# EAGLE design vending-machine-row-controller (EAGLE 5.12)
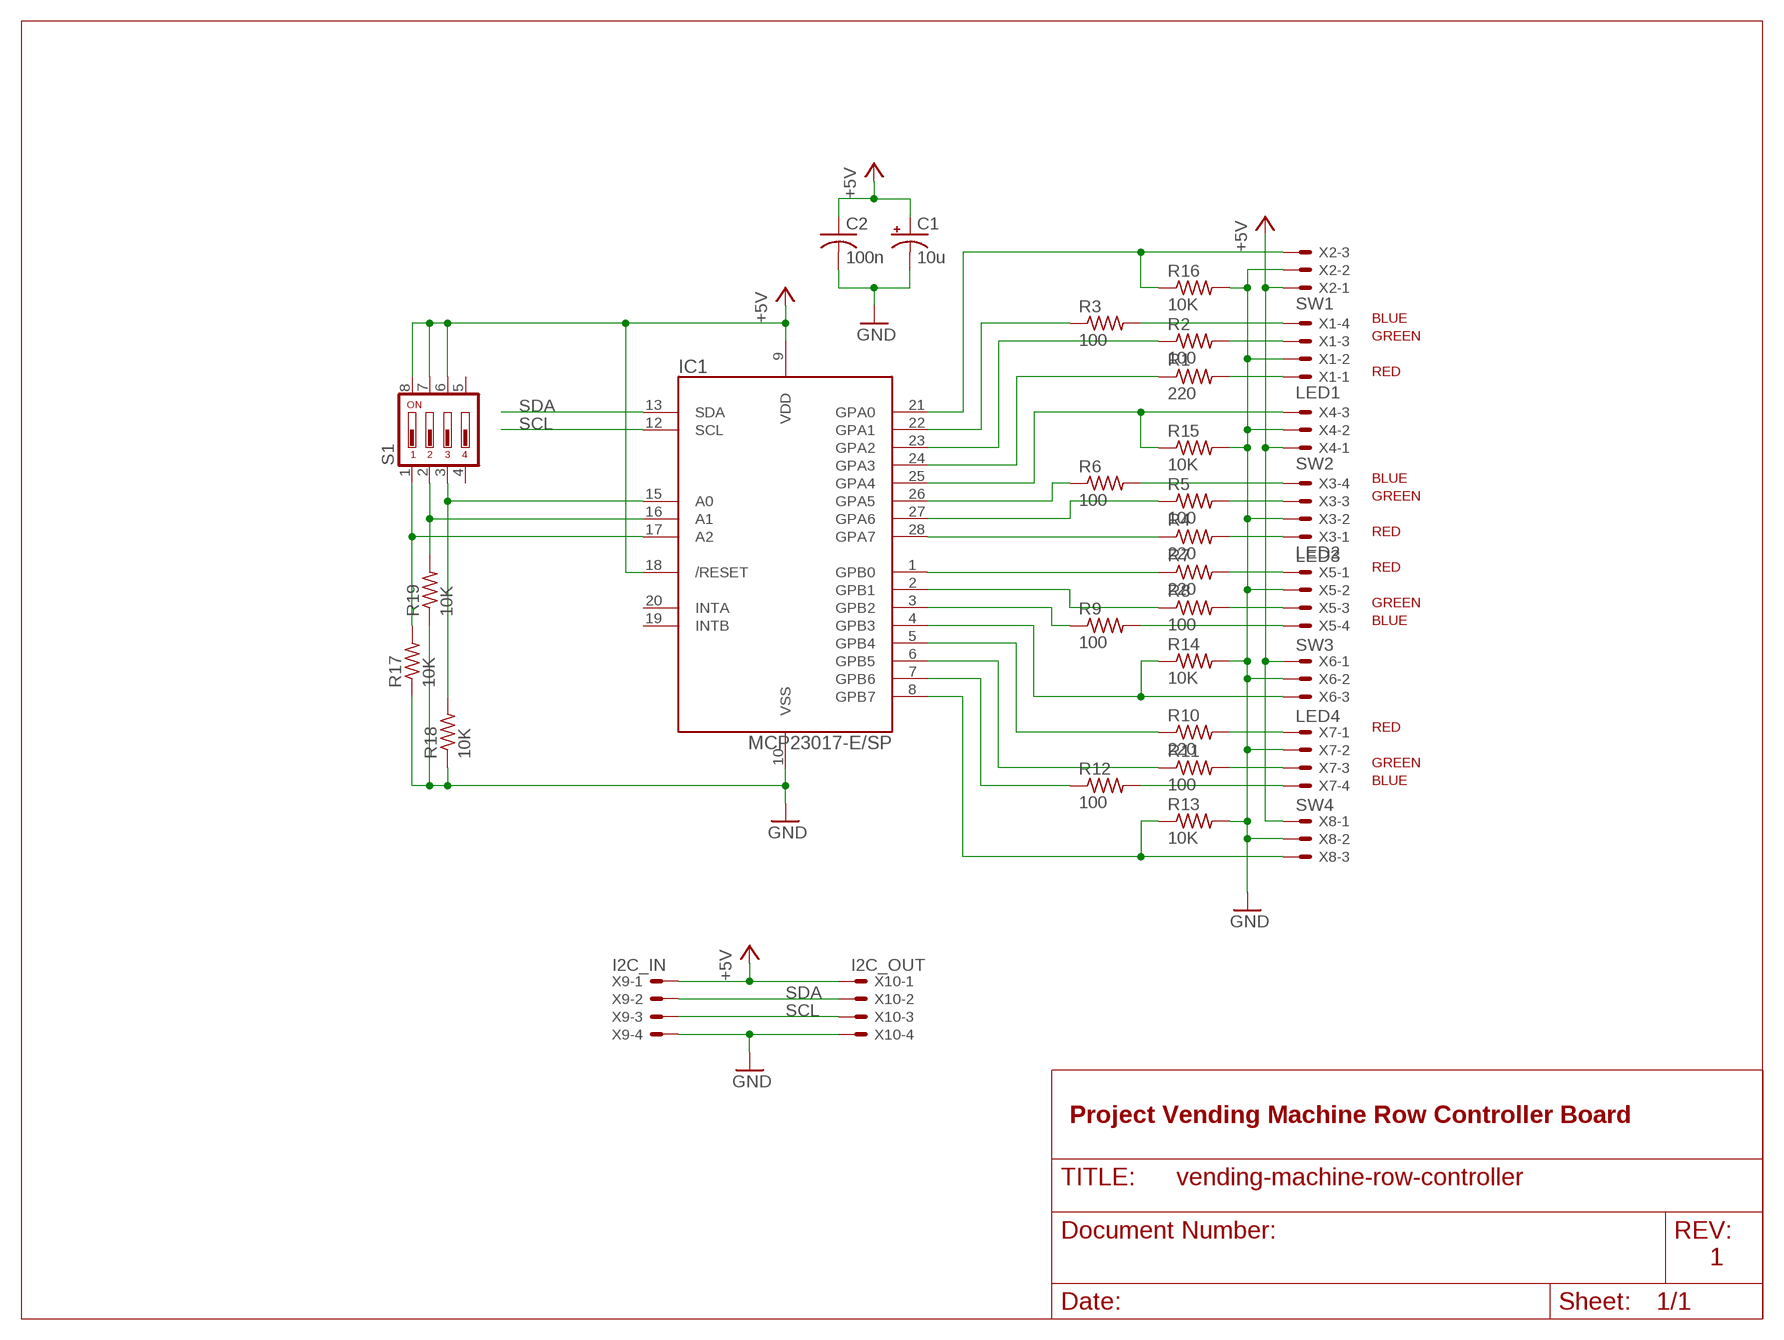
[diagram p0: schematic, sheet 1]

## Parts
C1  10u  CPOL-USE2.5-5  [E2,5-5]
C2  100n  C-US050-025X075  [C050-025X075]
IC1  MCP23017-E/SP  [DIP-28S]
R1  220  R-US_0207/10  [0207/10]
R2  100  R-US_0207/10  [0207/10]
R3  100  R-US_0207/10  [0207/10]
R4  220  R-US_0207/10  [0207/10]
R5  100  R-US_0207/10  [0207/10]
R6  100  R-US_0207/10  [0207/10]
R7  220  R-US_0207/10  [0207/10]
R8  100  R-US_0207/10  [0207/10]
R9  100  R-US_0207/10  [0207/10]
R10  220  R-US_0207/10  [0207/10]
R11  100  R-US_0207/10  [0207/10]
R12  100  R-US_0207/10  [0207/10]
R13  10K  R-US_0207/10  [0207/10]
R14  10K  R-US_0207/10  [0207/10]
R15  10K  R-US_0207/10  [0207/10]
R16  10K  R-US_0207/10  [0207/10]
R17  10K  R-US_R0805  [R0805]
R18  10K  R-US_R0805  [R0805]
R19  10K  R-US_R0805  [R0805]
S1  DIP04YL  [DIP04YL]
X1  LED1  22-23-2041  [22-23-2041]
X2  SW1  22-23-2031  [22-23-2031]
X3  LED2  22-23-2041  [22-23-2041]
X4  SW2  22-23-2031  [22-23-2031]
X5  LED3  22-23-2041  [22-23-2041]
X6  SW3  22-23-2031  [22-23-2031]
X7  LED4  22-23-2041  [22-23-2041]
X8  SW4  22-23-2031  [22-23-2031]
X9  I2C_IN  22-23-2041  [22-23-2041]
X10  I2C_OUT  22-23-2041  [22-23-2041]

## Nets
+5V: C1.+ C2.1 IC1.9(VDD) IC1.18(/RESET) S1.6 S1.7 S1.8 X2.1 X4.1 X6.1 X8.1 X9.1 X10.1
GND: C1.- C2.2 IC1.10(VSS) R13.2 R14.2 R15.2 R16.2 R17.1 R18.1 R19.1 X1.2 X2.2 X3.2 X4.2 X5.2 X6.2 X7.2 X8.2 X9.4 X10.4
N$1: R12.2 X7.4
N$2: R11.2 X7.3
N$3: R10.2 X7.1
N$4: R9.2 X5.4
N$5: R8.2 X5.3
N$6: R7.2 X5.1
N$7: R6.2 X3.4
N$8: R5.2 X3.3
N$9: R4.2 X3.1
N$10: R3.2 X1.4
N$11: R2.2 X1.3
N$12: R1.2 X1.1
N$13: IC1.17(A2) R17.2 S1.1
N$14: IC1.1(GPB0) R7.1
N$15: IC1.2(GPB1) R8.1
N$16: IC1.3(GPB2) R9.1
N$17: IC1.5(GPB4) R10.1
N$18: IC1.6(GPB5) R11.1
N$19: IC1.7(GPB6) R12.1
N$20: IC1.8(GPB7) R13.1 X8.3
N$21: IC1.4(GPB3) R14.1 X6.3
N$22: IC1.16(A1) R19.2 S1.2
N$23: IC1.28(GPA7) R4.1
N$24: IC1.27(GPA6) R5.1
N$25: IC1.26(GPA5) R6.1
N$26: IC1.25(GPA4) R15.1 X4.3
N$27: IC1.24(GPA3) R1.1
N$28: IC1.23(GPA2) R2.1
N$29: IC1.22(GPA1) R3.1
N$30: IC1.21(GPA0) R16.1 X2.3
N$31: IC1.15(A0) R18.2 S1.3
SCL: IC1.12(SCL) X9.3 X10.3
SDA: IC1.13(SDA) X9.2 X10.2
Unconnected: IC1.19(INTB) IC1.20(INTA) S1.4 S1.5

## Notes on the sheet
- BLUE
- GREEN
- RED
- BLUE
- GREEN
- RED
- RED
- GREEN
- BLUE
- RED
- GREEN
- BLUE
- Project Vending Machine Row Controller Board
- 1

## Library data of the parts
C1 = rcl:CPOL-US: POLARIZED CAPACITOR, American symbol
C2 = rcl:C-US: CAPACITOR, American symbol
IC1 = rbg-microchip-ioexpander:MCP23017
R1-R19 = rcl:R-US_: RESISTOR, American symbol
S1 = switch-dil:DIP04YL: DIL/CODE SWITCH; OC_FARNELL: unknown; OC_NEWARK: unknown
X1 X3 X5 X7 X9 X10 = con-molex:22-23-2041: .100" (2.54mm) Center Header - 4 Pin; MF: MOLEX; MPN: 22-23-2041; OC_FARNELL: 1462920; OC_NEWARK: 38C0355
X2 X4 X6 X8 = con-molex:22-23-2031: .100" (2.54mm) Center Header - 3 Pin; MF: MOLEX; MPN: 22-23-2031; OC_FARNELL: 1462950; OC_NEWARK: 30C0862

## Board
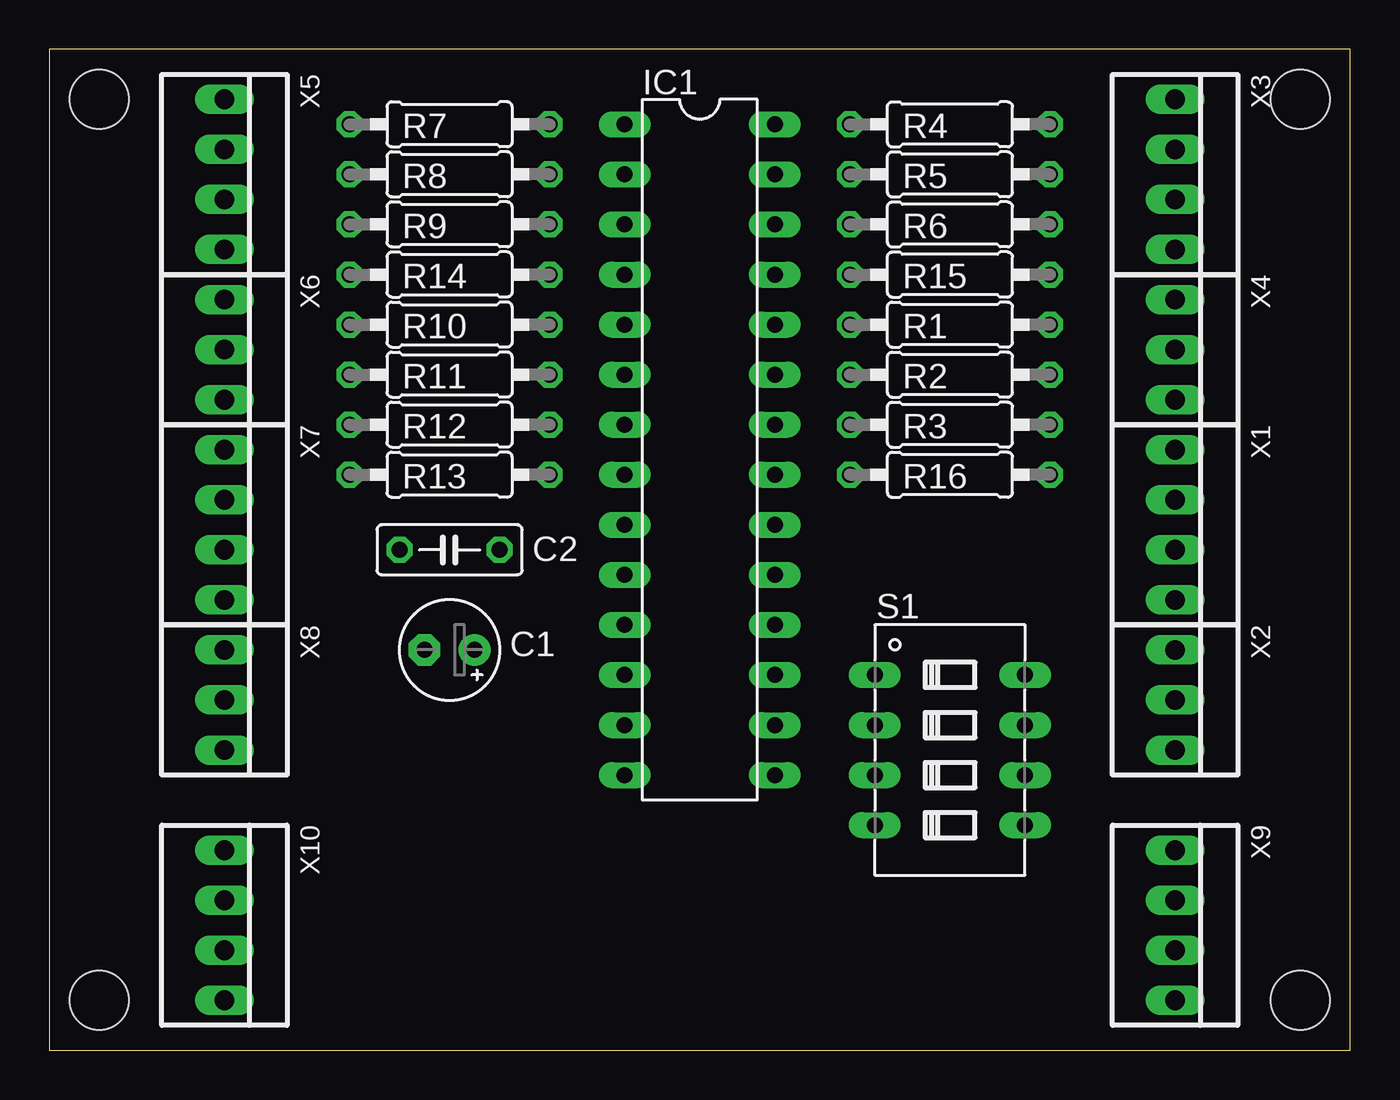
[diagram p1: board, top side]
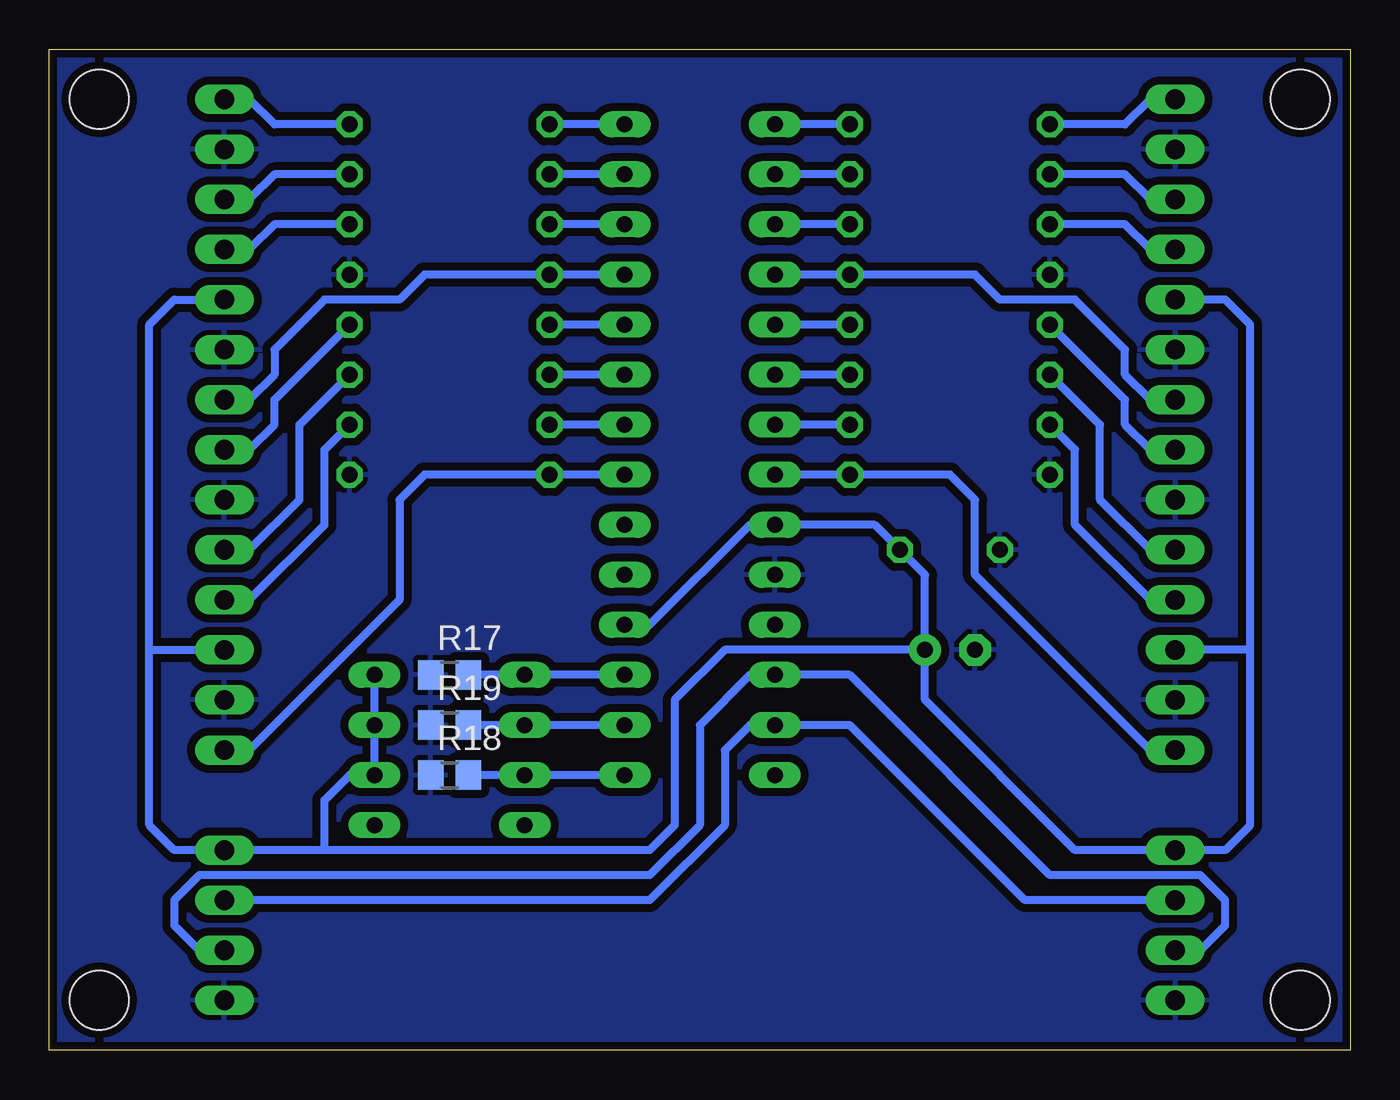
[diagram p2: board, bottom side, seen from below]

Size 66.04 x 50.8 mm. Coordinates in mm from the lower left corner, seen from the top.
Outline: 0,0 66.04,0 66.04,50.8 0,50.8 0,0
Copper layers (1*16): Top 0.035mm / dielectric 1.5mm / Bottom 0.035mm
Design rules "default *": minimum track width 10mil, minimum drill 24mil, track to track 8mil, track to pad 8mil, pad to pad 8mil, via to via 8mil, smd to smd 8mil, copper to edge 10mil, drill to drill 8mil, minimum pad ring 10mil, minimum via ring 8mil, stop-mask expansion 4mil, vias tented up to drill 0mil, thermal gap 10mil
Holes 3 mm at 2.54,2.54 2.54,48.26 63.5,2.54 63.5,48.26

### Footprints (pad centres in the part's own frame; a part is rotated, then mirrored left to right if it is on the bottom)
E2,5-5 = drill 0.813 pad 1.6 round: + -1.27,0 | drill 0.813 pad 1.6 octagon: - 1.27,0
C050-025X075 = drill 0.813 octagon: 1 -2.54,0; 2 2.54,0
DIP-28S = drill 0.813 long: 1 -16.51,-3.81; 2 -13.97,-3.81; 3 -11.43,-3.81; 4 -8.89,-3.81; 5 -6.35,-3.81; 6 -3.81,-3.81; 7 -1.27,-3.81; 8 1.27,-3.81; 9 3.81,-3.81; 10 6.35,-3.81; 11 8.89,-3.81; 12 11.43,-3.81; 13 13.97,-3.81; 14 16.51,-3.81; 15 16.51,3.81; 16 13.97,3.81; 17 11.43,3.81; 18 8.89,3.81; 19 6.35,3.81; 20 3.81,3.81; 21 1.27,3.81; 22 -1.27,3.81; 23 -3.81,3.81; 24 -6.35,3.81; 25 -8.89,3.81; 26 -11.43,3.81; 27 -13.97,3.81; 28 -16.51,3.81
0207/10 = drill 0.813 octagon: 1 -5.08,0; 2 5.08,0
R0805 = smd 1.3 x 1.5: 1 -0.95,0; 2 0.95,0
DIP04YL = drill 0.813 long: 1 -3.81,-3.81; 2 -1.27,-3.81; 3 1.27,-3.81; 4 3.81,-3.81; 5 3.81,3.81; 6 1.27,3.81; 7 -1.27,3.81; 8 -3.81,3.81
22-23-2041 = drill 1 long: 1 -3.81,0; 2 -1.27,0; 3 1.27,0; 4 3.81,0
22-23-2031 = drill 1 long: 1 -2.54,0; 2 0,0; 3 2.54,0

### Placement (x,y rotation side)
C1  20.32,20.32 180 top
C2  20.32,25.4 180 top
IC1  33.02,30.48 270 top
R1  45.72,36.83 0 top
R2  45.72,34.29 0 top
R3  45.72,31.75 0 top
R4  45.72,46.99 0 top
R5  45.72,44.45 0 top
R6  45.72,41.91 0 top
R7  20.32,46.99 180 top
R8  20.32,44.45 180 top
R9  20.32,41.91 180 top
R10  20.32,36.83 180 top
R11  20.32,34.29 180 top
R12  20.32,31.75 180 top
R13  20.32,29.21 180 top
R14  20.32,39.37 180 top
R15  45.72,39.37 0 top
R16  45.72,29.21 0 top
R17  45.72,19.05 0 bottom
R18  45.72,13.97 0 bottom
R19  45.72,16.51 0 bottom
S1  45.72,15.24 270 top
X1  57.15,26.67 270 top
X2  57.15,17.78 270 top
X3  57.15,44.45 270 top
X4  57.15,35.56 270 top
X5  8.89,44.45 270 top
X6  8.89,35.56 270 top
X7  8.89,26.67 270 top
X8  8.89,17.78 270 top
X9  57.15,6.35 270 top
X10  8.89,6.35 270 top

### Tracks (layer width: path | path; a pad name or v marks a point on that pad's centre or on a via)
+5V
  Bottom 0.406: 52.07,10.16 35.56,10.16 34.29,11.43 34.29,17.78 31.75,20.32 C1.+ | 52.07,10.16 X9.1 59.69,10.16 60.96,11.43 60.96,20.32 | C1.+ 21.59,17.78 13.97,10.16 X10.1 6.35,10.16 5.08,11.43 5.08,20.32 | C1.+ 21.59,24.13 C2.1 24.13,26.67 IC1.9 30.48,26.67 35.56,21.59 IC1.18 | X6.1 6.35,38.1 5.08,36.83 5.08,20.32 | 5.08,20.32 X8.1 | X4.1 59.69,38.1 60.96,36.83 60.96,20.32 | 60.96,20.32 X2.1 | S1.6 S1.7 S1.8 S1.6 | S1.6 50.8,13.97 52.07,12.7 52.07,10.16
GND
  pour Bottom (isolate 0.406): 0,52.07 67.31,52.07 67.31,0 67.31,-1.27 -1.27,-1.27 -1.27,52.07
N$1
  Bottom 0.406: R12.2 13.97,30.48 13.97,26.67 10.16,22.86 X7.4
N$2
  Bottom 0.406: R11.2 12.7,31.75 12.7,27.94 10.16,25.4 X7.3
N$3
  Bottom 0.406: R10.2 11.43,33.02 11.43,31.75 10.16,30.48 X7.1
N$4
  Bottom 0.406: R9.2 11.43,41.91 10.16,40.64 X5.4
N$5
  Bottom 0.406: R8.2 11.43,44.45 10.16,43.18 X5.3
N$6
  Bottom 0.406: R7.2 11.43,46.99 10.16,48.26 X5.1
N$7
  Bottom 0.406: R6.2 54.61,41.91 55.88,40.64 X3.4
N$8
  Bottom 0.406: R5.2 54.61,44.45 55.88,43.18 X3.3
N$9
  Bottom 0.406: R4.2 54.61,46.99 55.88,48.26 X3.1
N$10
  Bottom 0.406: R3.2 52.07,30.48 52.07,26.67 55.88,22.86 X1.4
N$11
  Bottom 0.406: R2.2 53.34,31.75 53.34,27.94 55.88,25.4 X1.3
N$12
  Bottom 0.406: R1.2 54.61,33.02 54.61,31.75 55.88,30.48 X1.1
N$13
  Bottom 0.406: IC1.17 S1.1 R17.2
N$14
  Bottom 0.406: R7.1 IC1.1
N$15
  Bottom 0.406: R8.1 IC1.2
N$16
  Bottom 0.406: R9.1 IC1.3
N$17
  Bottom 0.406: R10.1 IC1.5
N$18
  Bottom 0.406: R11.1 IC1.6
N$19
  Bottom 0.406: R12.1 IC1.7
N$20
  Bottom 0.406: IC1.8 R13.1 20.32,29.21 19.05,27.94 19.05,24.13 10.16,15.24 X8.3
N$21
  Bottom 0.406: IC1.4 R14.1 19.05,39.37 17.78,38.1 13.97,38.1 11.43,35.56 11.43,34.29 10.16,33.02 X6.3
N$22
  Bottom 0.406: IC1.16 S1.2 R19.2
N$23
  Bottom 0.406: IC1.28 R4.1
N$24
  Bottom 0.406: IC1.27 R5.1
N$25
  Bottom 0.406: IC1.26 R6.1
N$26
  Bottom 0.406: IC1.25 R15.1 46.99,39.37 48.26,38.1 52.07,38.1 54.61,35.56 54.61,34.29 55.88,33.02 X4.3
N$27
  Bottom 0.406: IC1.24 R1.1
N$28
  Bottom 0.406: IC1.23 R2.1
N$29
  Bottom 0.406: IC1.22 R3.1
N$30
  Bottom 0.406: IC1.21 R16.1 46.99,29.21 48.26,27.94 48.26,22.86 55.88,15.24 X2.3
N$31
  Bottom 0.406: R18.2 S1.3 IC1.15
SCL
  Bottom 0.406: X9.3 58.42,5.08 59.69,6.35 59.69,7.62 58.42,8.89 35.56,8.89 33.02,11.43 33.02,16.51 30.48,19.05 IC1.12 25.4,19.05 15.24,8.89 7.62,8.89 6.35,7.62 6.35,6.35 7.62,5.08 X10.3
SDA
  Bottom 0.406: X9.2 35.56,7.62 31.75,11.43 31.75,15.24 30.48,16.51 IC1.13 25.4,16.51 16.51,7.62 X10.2